# EAGLE design psychoholics_pin (EAGLE 7.5.0)
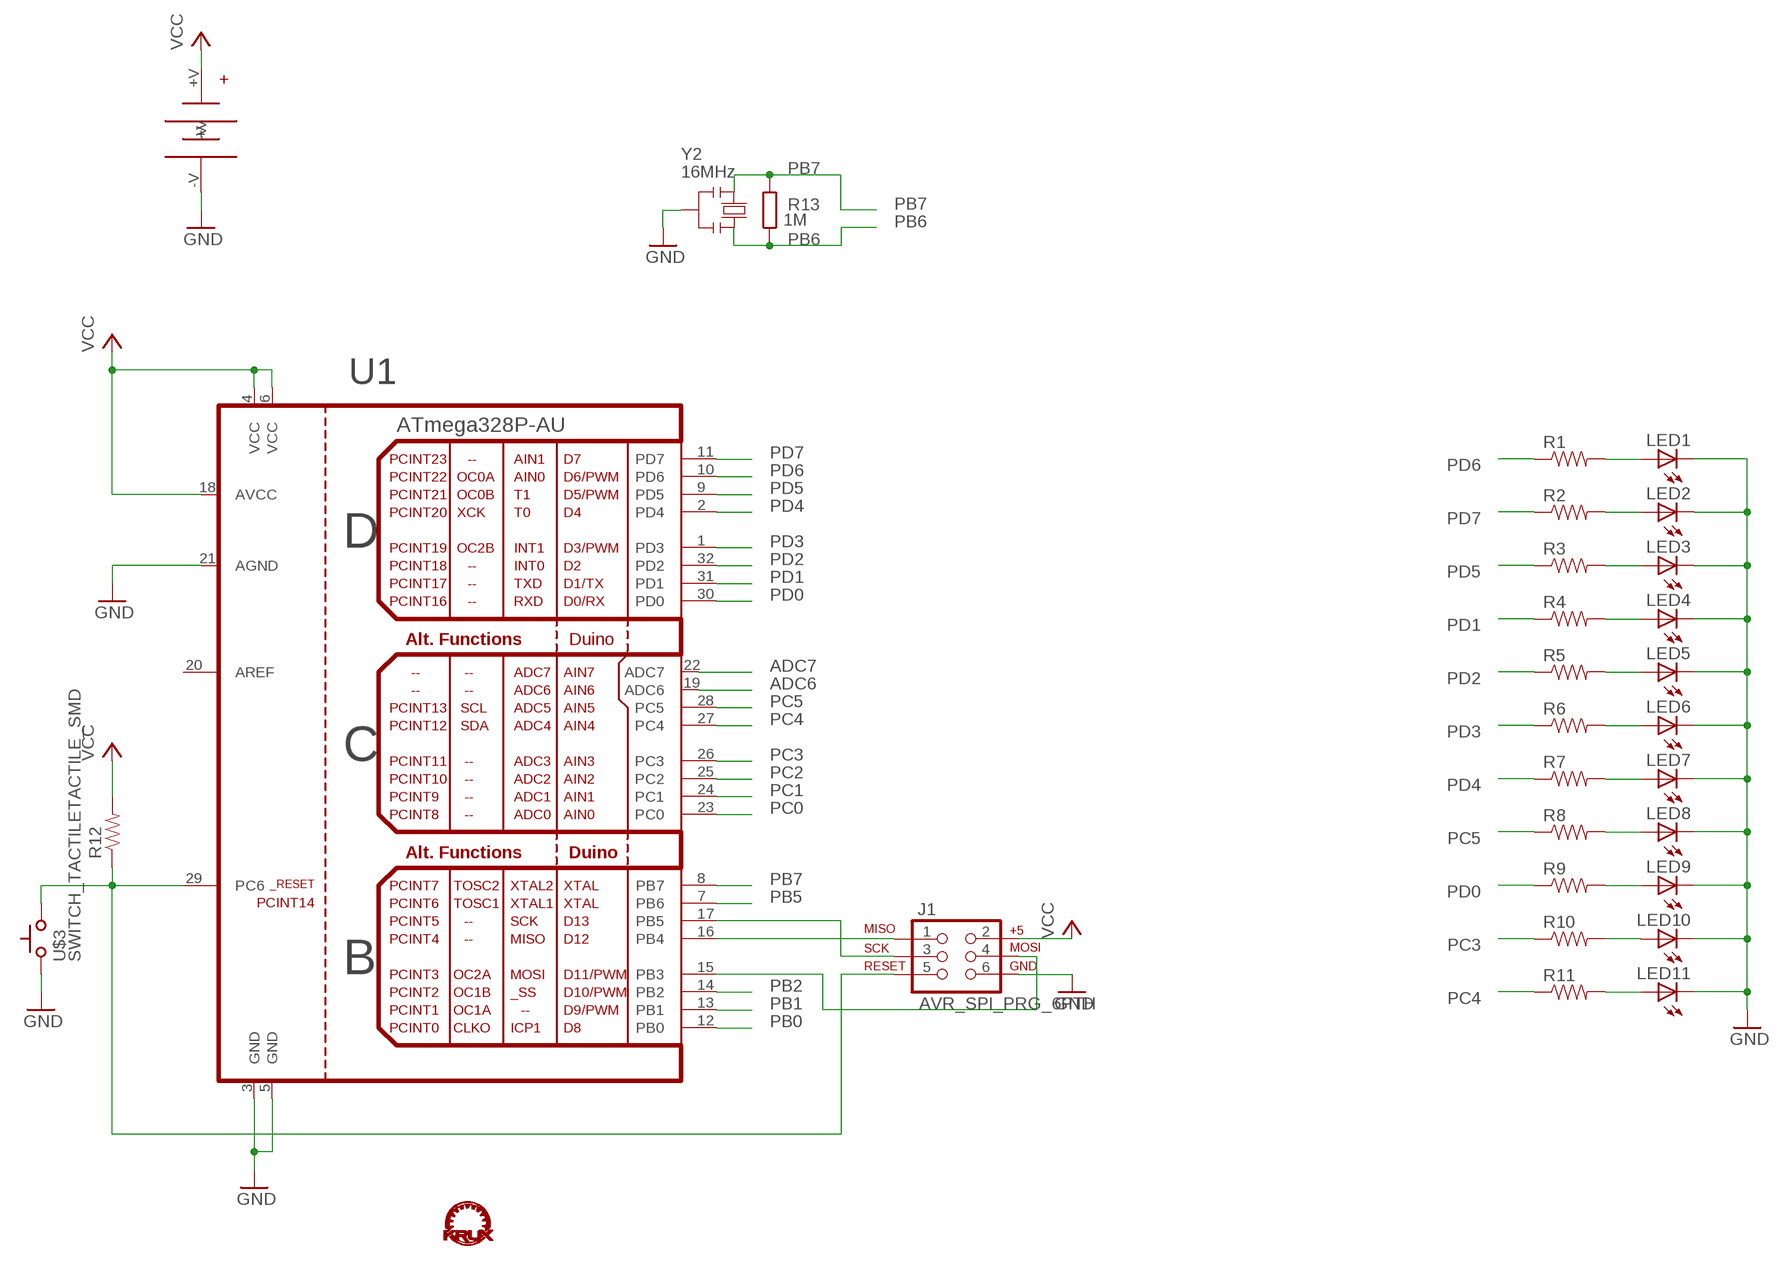
[diagram p0: schematic, sheet 1]

## Parts
J1  AVR_SPI_PRG_6PTH  [2X3]
LED1  LEDREVERSEMOUNT  [GULLWING_LED]
LED2  LEDREVERSEMOUNT  [GULLWING_LED]
LED3  LEDREVERSEMOUNT  [GULLWING_LED]
LED4  LEDREVERSEMOUNT  [GULLWING_LED]
LED5  LEDREVERSEMOUNT  [GULLWING_LED]
LED6  LEDREVERSEMOUNT  [GULLWING_LED]
LED7  LEDREVERSEMOUNT  [GULLWING_LED]
LED8  LEDREVERSEMOUNT  [GULLWING_LED]
LED9  LEDREVERSEMOUNT  [GULLWING_LED]
LED10  LEDREVERSEMOUNT  [GULLWING_LED]
LED11  LEDREVERSEMOUNT  [GULLWING_LED]
R1  RESISTOR0603-RES  [0603-RES]
R2  RESISTOR0603-RES  [0603-RES]
R3  RESISTOR0603-RES  [0603-RES]
R4  RESISTOR0603-RES  [0603-RES]
R5  RESISTOR0603-RES  [0603-RES]
R6  RESISTOR0603-RES  [0603-RES]
R7  RESISTOR0603-RES  [0603-RES]
R8  RESISTOR0603-RES  [0603-RES]
R9  RESISTOR0603-RES  [0603-RES]
R10  RESISTOR0603-RES  [0603-RES]
R11  RESISTOR0603-RES  [0603-RES]
R12  RESISTOR0603-RES  [0603-RES]
R13  1M  R-EU_R0603  [R0603-ROUND]
U1  ATmega328P-AU  ATMEGA328TQFP-32-08-THIN  [TQFP-32-08-THIN]
U$1  KRUX_LOGO  [KRUX_LOGO]
U$2  12BH423-GR12BH423-GR_NOBORDER  [12BH423-GR_NOBORDER]
U$3  SWITCH_TACTILETACTILE_SMD  [TACTILE_SWITCH_SMD]
Y2  16MHz  RESONATORMU  [RESONATOR]

## Nets
ADC6: U1.19(ADC6)
ADC7: U1.22(ADC7)
GND: J1.6 LED1.C LED2.C LED3.C LED4.C LED5.C LED6.C LED7.C LED8.C LED9.C LED10.C LED11.C U1.3(GND) U1.5(GND) U1.21(AGND) U$2.-V U$3.3(C) U$3.4(C) Y2.2
N$1: LED11.A R11.2
N$2: LED10.A R10.2
N$3: LED9.A R9.2
N$4: LED8.A R8.2
N$5: LED7.A R7.2
N$6: LED6.A R6.2
N$7: LED5.A R5.2
N$8: LED4.A R4.2
N$9: LED3.A R3.2
N$10: LED2.A R2.2
N$11: LED1.A R1.2
N$34: J1.5 R12.1 U1.29(PC6) U$3.1(A) U$3.2(A)
PB0: U1.12(PB0)
PB1: U1.13(PB1)
PB2: U1.14(PB2)
PB3: J1.4 U1.15(PB3)
PB4: J1.1 U1.16(PB4)
PB5: J1.3 U1.17(PB5)
PB6: R13.1 U1.7(PB6) Y2.3
PB7: R13.2 U1.8(PB7) Y2.1
PC0: U1.23(PC0)
PC1: U1.24(PC1)
PC2: U1.25(PC2)
PC3: R10.1 U1.26(PC3)
PC4: R11.1 U1.27(PC4)
PC5: R8.1 U1.28(PC5)
PD0: R9.1 U1.30(PD0)
PD1: R4.1 U1.31(PD1)
PD2: R5.1 U1.32(PD2)
PD3: R6.1 U1.1(PD3)
PD4: R7.1 U1.2(PD4)
PD5: R3.1 U1.9(PD5)
PD6: R1.1 U1.10(PD6)
PD7: R2.1 U1.11(PD7)
VCC: J1.2 R12.2 U1.4(VCC) U1.6(VCC) U1.18(AVCC) U$2.+V
Unconnected: U1.20(AREF)

## Library data of the parts
J1 = SparkFun:AVR_SPI_PRG_6: AVR ISP 6 Pin This is the reduced ISP connector for AVR programming. Common on Arduino. This footprint will take up less PCB space and can be used with a 10-pin to 6-pin adapter such as SKU: BOB-08508
LED1-LED11 = SYNShop:LED: LEDs Standard schematic elements and footprints for 5mm, 3mm, 1206, and 0603 sized LEDs. 5mm - Spark Fun Electronics SKU : COM-00529 (and others)
R1-R12 = SYNShop:RESISTOR: Resistor Basic schematic elements and footprints for 0603, 1206, and PTH resistors.
R13 = SmartPrj:R-EU_: RESISTOR, European symbol
U1 = atmel-atmega:ATMEGA328
U$1 = SYNShop:KRUX_LOGO
U$2 = SYNShop:12BH423-GR
U$3 = SYNShop:SWITCH_TACTILE
Y2 = SmartPrj:RESONATOR

## Net classes
0 default: width 0.152 mm, clearance 0.152 mm
2 gnd: width 0.203 mm, drill 0.559 mm, clearance 0.152 mm

## Board
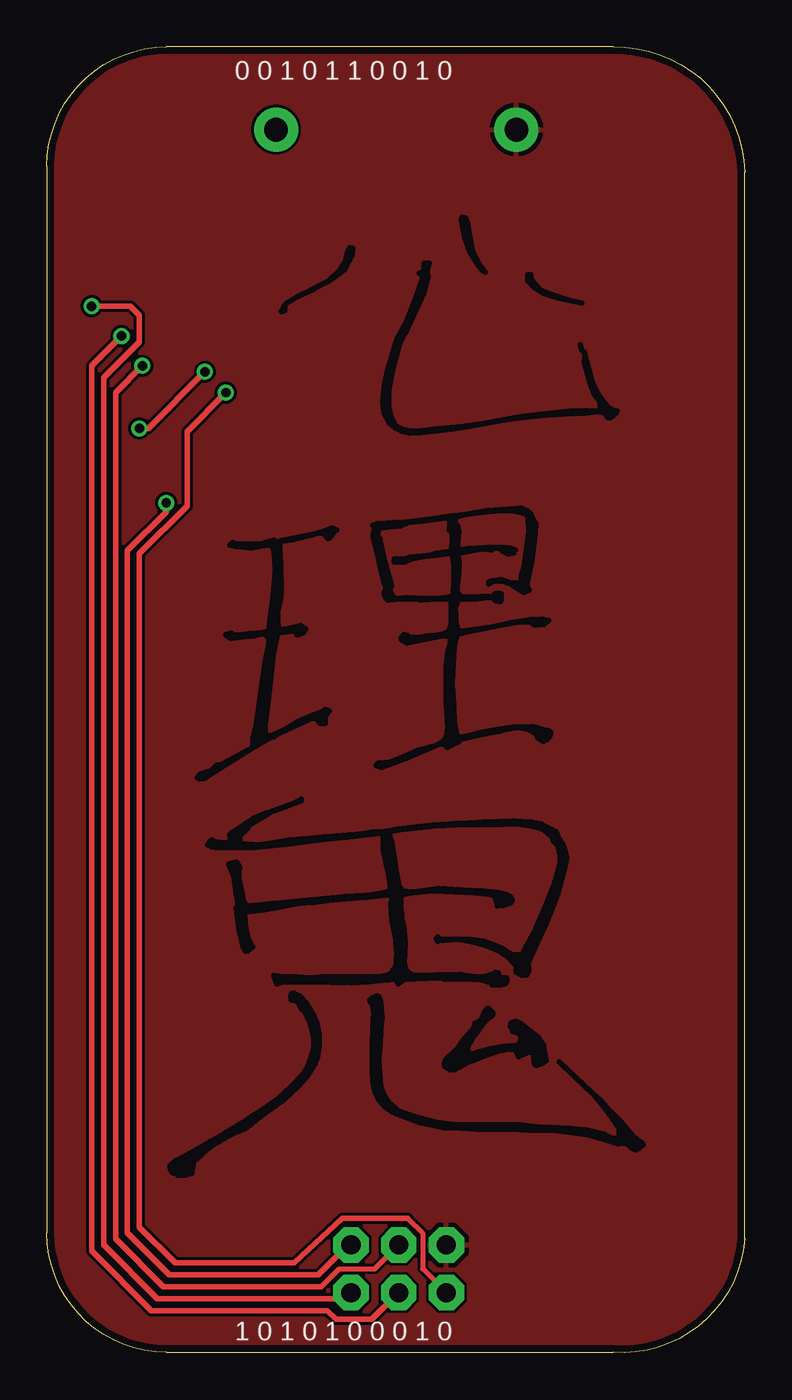
[diagram p1: board, top side]
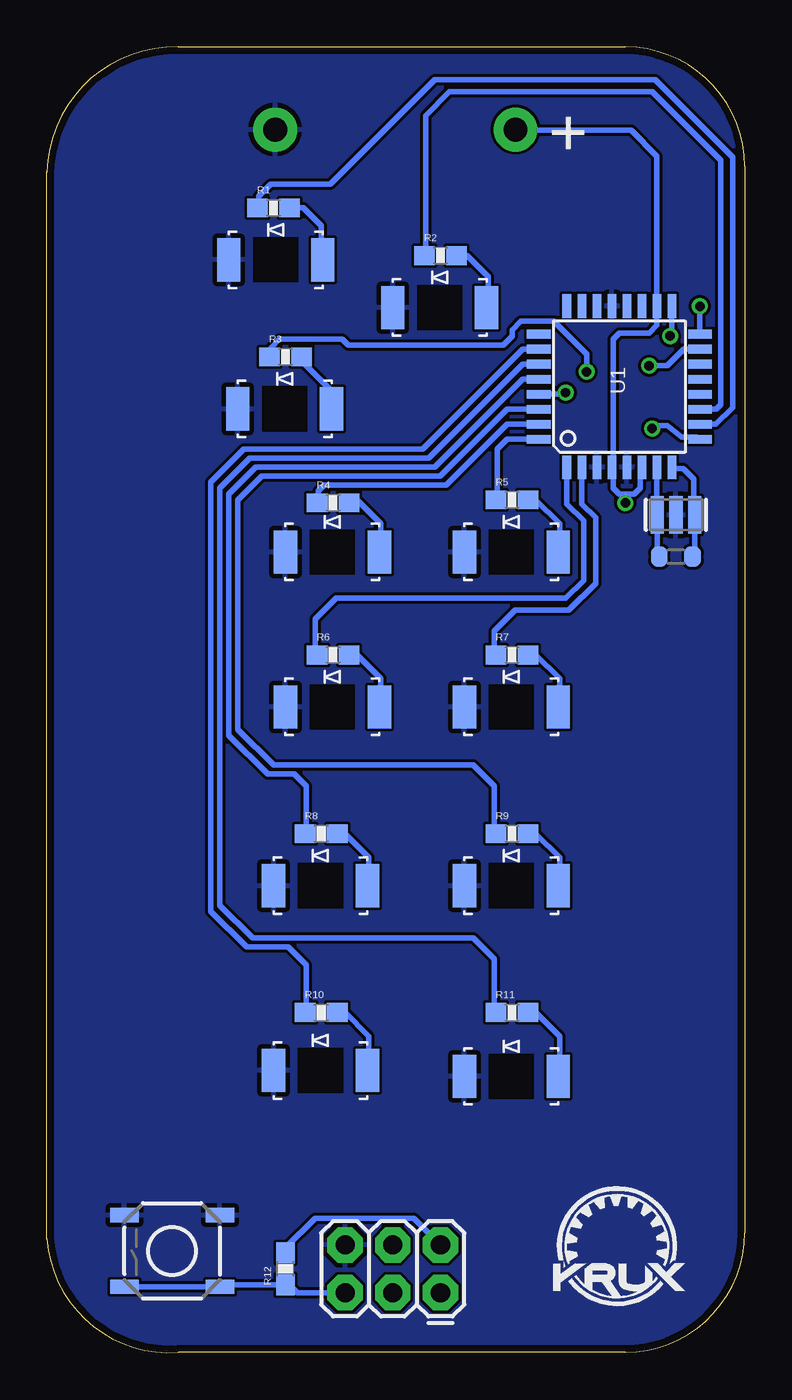
[diagram p2: board, bottom side, seen from below]

Size 37.15 x 69.55 mm. Coordinates in mm from the lower left corner, seen from the top.
Outline: 6.35,0.02 30.16,0.02 arc90 37.15,6.05 37.15,62.88 arc90 30.16,69.55 6.35,69.55 arc90 0,63.2 0,6.37 arc90 6.35,0.02
Copper layers (1*16): Top 0.0356mm / dielectric 1.5011mm / Bottom 0.0356mm
Design rules "LaenPCBOrder": minimum track width 6mil, minimum drill 13mil, track to track 6mil, track to pad 6mil, pad to pad 6mil, via to via 6mil, smd to smd 6mil, copper to edge 15mil, drill to drill 6mil, minimum pad ring 7mil, minimum via ring 7mil, stop-mask expansion 4mil, vias tented up to drill 0mil, thermal gap 10mil
tRestrict: 915 lines

### Footprints (pad centres in the part's own frame; a part is rotated, then mirrored left to right if it is on the bottom)
2X3 = drill 1.016 pad 1.88 octagon: 1 0,0; 2 0,2.54; 3 2.54,0; 4 2.54,2.54; 5 5.08,0; 6 5.08,2.54
GULLWING_LED = smd 1.245 x 2.3: A 5,-1.5; C 0,-1.5
0603-RES = smd 1.1 x 1: 1 -0.85,0; 2 0.85,0
R0603-ROUND = smd 0.898 x 1.1: 1 -0.889,0; 2 0.889,0
TQFP-32-08-THIN = smd 1.27 x 0.457: 1 -4.293,2.8; 2 -4.293,2; 3 -4.293,1.2; 4 -4.293,0.4; 5 -4.293,-0.4; 6 -4.293,-1.2; 7 -4.293,-2; 8 -4.293,-2.8; 17 4.293,-2.8; 18 4.293,-2; 19 4.293,-1.2; 20 4.293,-0.4; 21 4.293,0.4; 22 4.293,1.2; 23 4.293,2; 24 4.293,2.8 | smd 0.457 x 1.27: 9 -2.8,-4.293; 10 -2,-4.293; 11 -1.2,-4.293; 12 -0.4,-4.293; 13 0.4,-4.293; 14 1.2,-4.293; 15 2,-4.293; 16 2.8,-4.293; 25 2.8,4.293; 26 2,4.293; 27 1.2,4.293; 28 0.4,4.293; 29 -0.4,4.293; 30 -1.2,4.293; 31 -2,4.293; 32 -2.8,4.293
12BH423-GR_NOBORDER = drill 1.27 pad 2.337: +V 5.85,2.5; -V 18.65,2.5
TACTILE_SWITCH_SMD = smd 1.524 x 0.762: 1 -2.54,1.905; 2 2.54,1.905; 3 -2.54,-1.905; 4 2.54,-1.905
RESONATOR = smd 0.7 x 2: 1 -1,0; 2 0,0; 3 1,0

### Placement (x,y rotation side)
J1  16.19,3.19 0 top
LED1  27.46,59.71 0 bottom
LED2  18.73,57.17 0 bottom
LED3  26.99,51.77 0 bottom
LED4  24.45,44.15 0 bottom
LED5  14.92,44.15 0 bottom
LED6  24.45,35.89 0 bottom
LED7  14.92,35.89 0 bottom
LED8  25.08,26.37 0 bottom
LED9  14.92,26.37 0 bottom
LED10  25.08,16.53 0 bottom
LED11  14.92,16.21 0 bottom
R1  25.08,60.98 0 bottom
R2  16.19,58.44 0 bottom
R3  24.45,53.04 0 bottom
R4  21.91,45.26 0 bottom
R5  12.38,45.42 0 bottom
R6  21.91,37.16 0 bottom
R7  12.38,37.16 0 bottom
R8  22.54,27.64 0 bottom
R9  12.38,27.64 0 bottom
R10  22.54,18.11 0 bottom
R11  12.38,18.11 0 bottom
R12  24.45,4.46 90 bottom
R13  3.65,42.4 0 bottom
U1  6.67,51.45 90 bottom
U$1  6.83,5.73 0 bottom
U$2  6.35,67.64 180 bottom
U$3  30.48,5.41 180 bottom
Y2  3.65,44.62 180 bottom

### Tracks (layer width: path | path; a pad name or v marks a point on that pad's centre or on a via)
GND
  pour Top: 6.35,69.23 30.16,69.23 arc-90 36.83,62.88 36.83,6.05 arc-90 30.16,0.33 6.35,0.33 arc-90 0.32,6.37 0.32,63.2 arc-90
  pour Bottom: 30.16,0.33 6.35,0.33 arc-90 0.32,6.37 0.32,63.2 arc-90 6.35,69.23 30.16,69.23 arc-90 36.83,62.88 36.83,6.05 arc-90
N$1
  Bottom 0.305: R11.2 11.11,18.11 9.84,16.84 9.84,15.42 LED11.A
N$2
  Bottom 0.305: R10.2 21.27,18.11 20,16.84 20,15.42 LED10.A
N$3
  Bottom 0.305: R9.2 11.11,27.64 9.84,26.37 9.84,24.95 LED9.A
N$4
  Bottom 0.305: R8.2 21.27,27.64 20,26.37 20,24.95 LED8.A
N$5
  Bottom 0.305: R7.2 11.11,37.16 9.84,35.89 9.84,34.47 LED7.A
N$6
  Bottom 0.305: R6.2 20.64,37.16 19.37,35.89 19.37,34.47 LED6.A
N$7
  Bottom 0.305: R5.2 11.11,45.42 9.84,44.15 9.84,42.73 LED5.A
N$8
  Bottom 0.305: R4.2 20.64,45.42 19.37,44.15 19.37,42.73 LED4.A
N$9
  Bottom 0.305: R3.2 23.65,52.88 21.91,51.13 21.91,49.71 LED3.A
N$10
  Bottom 0.305: R2.2 14.76,58.44 13.65,57.32 13.65,55.75 LED2.A
N$11
  Bottom 0.305: R1.2 23.5,60.98 22.54,60.02 22.54,58.13 LED1.A
N$34  (via drill 0.5)
  Top 0.254: 19.21,7.16 20,6.37 20,4.46 J1.5
  Top 0.305: v9.52,51.13 7.46,49.07 7.46,45.1 4.92,42.56 4.92,6.68 6.83,4.78 13.18,4.78 15.72,7.16 19.21,7.16
  Bottom 0.305: U1.29 9.61,51.05 v9.52,51.13 | J1.5 23.81,3.19 24.23,3.61 R12.1 27.84,3.61 U$3.1 U$3.2
PB3  (via drill 0.5)
  Top 0.254: 14.61,3.51 15.56,4.46 17.46,4.46 J1.4
  Top 0.305: v5.08,52.56 3.65,51.13 3.65,6.05 6.19,3.51 14.61,3.51
  Bottom 0.305: U1.15 3.24,53.45 4.13,52.56 v5.08,52.56
PB4  (via drill 0.5)
  Top 0.305: v2.38,55.74 4.45,55.74 4.92,55.26 4.92,53.83 3.02,51.93 3.02,5.73 5.87,2.87 15.87,2.87 J1.1
  Bottom 0.305: U1.16 v2.37,55.73 v2.38,55.74
PB5  (via drill 0.5)
  Top 0.305: v3.97,54.15 2.38,52.56 2.38,5.41 5.56,2.24 14.92,2.24 15.4,1.76 17.3,1.76 J1.3
  Bottom 0.305: U1.17 3.87,54.25 v3.97,54.15
PB6
  Bottom 0.305: U1.7 4.67,44.64 Y2.3 4.65,42.51 R13.1
PB7
  Bottom 0.305: U1.8 3.81,47.1 3.27,47.1 2.7,46.53 2.7,44.67 Y2.1 2.65,42.51 R13.2
PC3
  Bottom 0.305: U1.26 11.81,53.45 17.14,48.12 26.67,48.12 28.42,46.37 28.42,23.51 26.51,21.61 24.29,21.61 23.34,20.65 23.34,18.17 R10.1
PC4
  Bottom 0.305: U1.27 11.82,52.65 16.83,47.64 26.35,47.64 27.94,46.05 27.94,23.83 26.19,22.08 14.45,22.08 13.34,20.97 13.34,18.22 R11.1
PC5
  Bottom 0.305: U1.28 11.82,51.85 16.51,47.16 26.04,47.16 27.46,45.74 27.46,32.88 25.4,30.81 23.97,30.81 23.34,30.18 23.34,27.69 R8.1
PD0
  Bottom 0.305: U1.30 12.63,50.25 16.19,46.69 25.72,46.69 26.99,45.42 26.99,33.19 25.08,31.29 14.45,31.29 13.34,30.18 13.34,27.74 R9.1
PD1
  Bottom 0.305: U1.31 12.64,49.45 15.87,46.21 22.38,46.21 22.7,45.89 22.7,45.47 R4.1
PD2
  Bottom 0.305: U1.32 12.64,48.65 13.18,48.12 13.18,45.47 R5.1
PD3
  Bottom 0.305: U1.1 9.47,45.2 8.57,44.31 8.57,41.13 9.52,40.18 21.75,40.18 22.86,39.07 22.86,37.27 R6.1
PD4
  Bottom 0.305: U1.2 8.67,45.2 7.94,44.47 7.94,40.97 9.37,39.54 12.22,39.54 13.34,38.43 13.34,37.27 R7.1
PD5  (via drill 0.5)
  Top 0.305: v4.92,49.23 5.4,49.23 v8.41,52.24
  Bottom 0.305: U1.9 2.54,48.75 3.33,48.75 4.13,49.39 4.6,49.39 v4.92,49.23 | v8.41,52.24 8.41,53.2 10.16,54.94 11.91,54.94 12.38,54.47 12.38,54.15 12.86,53.67 21.11,53.67 21.43,53.99 24.76,53.99 25.24,53.51 25.24,52.94 R3.1
PD6
  Bottom 0.305: U1.10 1.52,49.45 0.64,50.34 0.64,63.67 4.76,67.8 16.51,67.8 22.07,62.25 25.24,62.25 25.88,61.61 25.88,60.71 R1.1
PD7
  Bottom 0.305: U1.11 1.52,50.25 1.27,50.5 1.27,63.52 4.92,67.17 15.72,67.17 16.99,65.9 16.99,58.49 R2.1
VCC  (via drill 0.5)
  Top 0.305: J1.2 16.03,5.73 14.45,4.14 6.51,4.14 4.29,6.37 4.29,42.72 6.35,44.78 v6.35,45.26
  Bottom 0.305: U$2.+V 12.16,65.1 6.03,65.1 4.67,63.74 U1.18 4.67,54.72 5.08,54.31 6.67,54.31 6.98,53.99 6.98,47.24 | 6.98,47.24 U1.4 | 6.98,47.24 6.98,46.05 6.67,45.74 6.35,45.74 | 6.35,45.74 5.87,45.74 5.56,46.05 5.56,47.09 U1.6 | v6.35,45.26 6.35,45.74 | R12.2 24.45,5.57 22.86,7.16 17.62,7.16 J1.2

### Text on the board
tStop: P / S / Y / C / H / O / H / O / L / I / C / S
_tsilk: 0 0 1 0 1 1 0 0 1 0 | 1 0 1 0 1 0 0 0 1 0